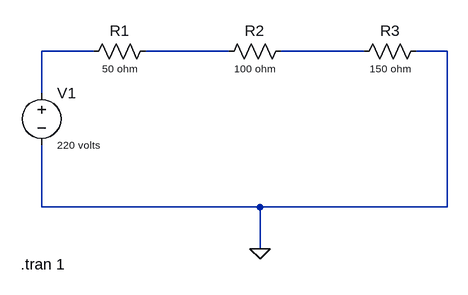
[diagram p0: schematic Draft4.asc]
Draft4.asc, the LTspice schematic file:
Version 4
SHEET 1 880 680
WIRE -16 144 -96 144
WIRE 192 144 64 144
WIRE 400 144 272 144
WIRE 528 144 480 144
WIRE -96 208 -96 144
WIRE -96 384 -96 288
WIRE 240 384 -96 384
WIRE 528 384 528 144
WIRE 528 384 240 384
WIRE 240 448 240 384
FLAG 240 448 0
SYMBOL res 80 128 R90
WINDOW 0 0 56 VBottom 2
WINDOW 3 32 56 VTop 1
SYMATTR InstName R1
SYMATTR Value 50 ohm
SYMBOL res 288 128 R90
WINDOW 0 0 56 VBottom 2
WINDOW 3 32 56 VTop 1
SYMATTR InstName R2
SYMATTR Value 100 ohm
SYMBOL res 496 128 R90
WINDOW 0 0 56 VBottom 2
WINDOW 3 32 56 VTop 1
SYMATTR InstName R3
SYMATTR Value 150 ohm
SYMBOL voltage -96 192 R0
WINDOW 3 24 96 Left 1
SYMATTR InstName V1
SYMATTR Value 220 volts
TEXT -128 472 Left 2 !.tran 1

The netlist it stands for:
* Draft4.asc
R1 N002 N001 50 ohm
R2 N003 N002 100 ohm
R3 0 N003 150 ohm
V1 N001 0 220 volts
.tran 1
.backanno
.end